# Altium schematic sheet MCU.SchDoc
size A4
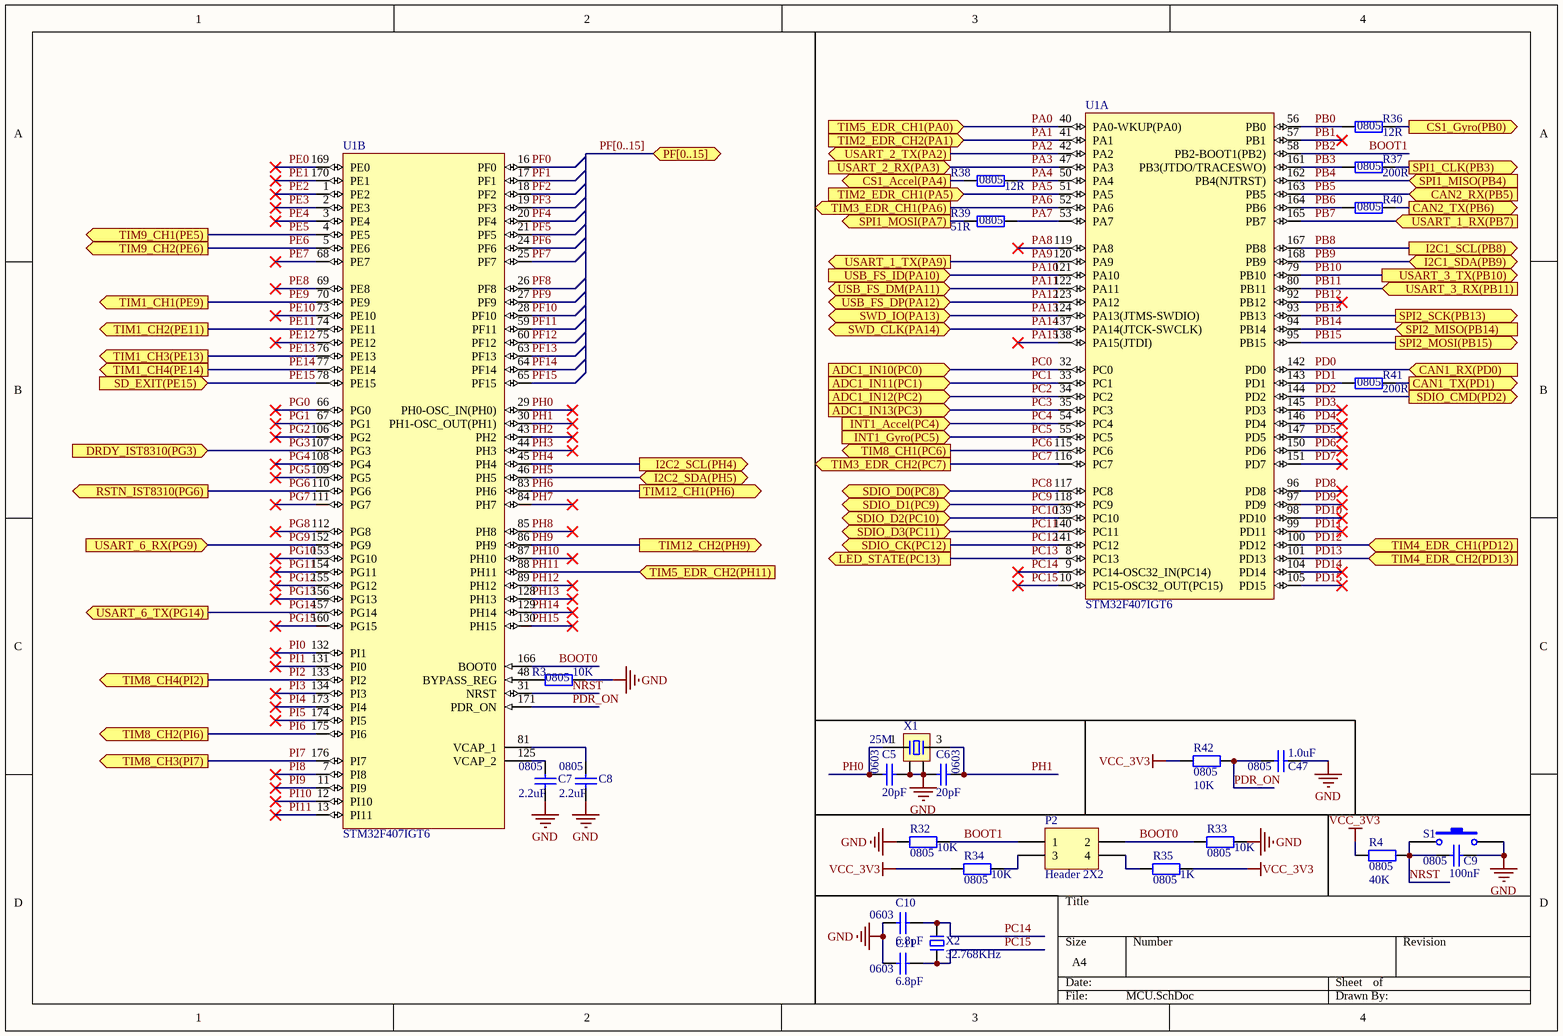
[diagram p0: MCU.SchDoc]

## Parts
C5  0603  value 20pF  [C 0603_L]
C6  0603  value 20pF  [C 0603_L]
C7  0805  value 2.2uF  [C 0805_M]
C8  0805  value 2.2uF  [C 0805_M]
C9  0805  value 100nF  [C 0805_M]
C10  0603  value 6.8pF  [C 0603_M]
C11  0603  value 6.8pF  [C 0603_L]
C47  0805  value 1.0uF  [C 0805_M]
P2  Header 2X2  [HDR2.54-LI-2x2P]
R3  0805  value 10K  [R 0805_L]
R4  0805  value 40K  [R 0805_L]
R32  0805  value 10K  [R 0805_L]
R33  0805  value 10K  [R 0805_L]
R34  0805  value 10K  [R 0805_L]
R35  0805  value 1K  [R 0805_L]
R36  0805  value 12R  [R 0805_L]
R37  0805  value 200R  [R 0805_L]
R38  0805  value 12R  [R 0805_L]
R39  0805  value 51R  [R 0805_L]
R40  0805  [R 0805_L]
R41  0805  value 200R  [R 0805_L]
R42  0805  value 10K  [R 0805_L]
S1  SW  [TSW DIP-3*6*4.3]  (value not drawn)
U1  STM32F407IGT6  [STM-LQFP176_N]  (parts A,B of 3)
X1  25M  [XTAL-3225]
X2  32.768KHz  [XTAL-3215A]

## Ports
ADC1_IN10(PC0) (in), ADC1_IN11(PC1) (in), ADC1_IN12(PC2) (in), ADC1_IN13(PC3) (in), CAN1_RX(PD0) (in), CAN1_TX(PD1) (out), CAN2_RX(PB5) (in), CAN2_TX(PB6) (out), CS1_Accel(PA4) (out), CS1_Gyro(PB0) (out), DRDY_IST8310(PG3) (in), I2C1_SCL(PB8) (out), I2C1_SDA(PB9) (bidir), I2C2_SCL(PH4) (out), I2C2_SDA(PH5) (bidir), INT1_Accel(PC4) (in), INT1_Gyro(PC5) (in), LED_STATE(PC13) (out), PF[0..15] (bidir), RSTN_IST8310(PG6) (out), SD_EXIT(PE15) (in), SDIO_CK(PC12) (out), SDIO_CMD(PD2) (out), SDIO_D0(PC8) (bidir), SDIO_D1(PC9) (bidir), SDIO_D2(PC10) (bidir), SDIO_D3(PC11) (bidir), SPI1_CLK(PB3) (out), SPI1_MISO(PB4) (in), SPI1_MOSI(PA7) (out), SPI2_MISO(PB14) (in), SPI2_MOSI(PB15) (out), SPI2_SCK(PB13) (out), SWD_CLK(PA14) (bidir), SWD_IO(PA13) (bidir), TIM1_CH1(PE9) (out), TIM1_CH2(PE11) (out), TIM1_CH3(PE13) (out), TIM1_CH4(PE14) (out), TIM2_EDR_CH1(PA5) (in), TIM2_EDR_CH2(PA1) (in), TIM3_EDR_CH1(PA6) (out), TIM3_EDR_CH2(PC7) (out), TIM4_EDR_CH1(PD12) (in), TIM4_EDR_CH2(PD13) (in), TIM5_EDR_CH1(PA0) (in), TIM5_EDR_CH2(PH11) (in), TIM8_CH1(PC6) (out), TIM8_CH2(PI6) (out), TIM8_CH3(PI7) (out), TIM8_CH4(PI2) (out), TIM9_CH1(PE5) (out), TIM9_CH2(PE6) (out), TIM12_CH1(PH6) (out), TIM12_CH2(PH9) (out), USART_1_RX(PB7) (in), USART_1_TX(PA9) (out), USART_2_RX(PA3) (in), USART_2_TX(PA2) (out), USART_3_RX(PB11) (in), USART_3_TX(PB10) (out), USART_6_RX(PG9) (in), USART_6_TX(PG14) (out), USB_FS_DM(PA11) (bidir), USB_FS_DP(PA12) (bidir), USB_FS_ID(PA10) (in)

## Nets
GND: C5.2 C6.1 C7.1 C8.1 C9.1 C10.1 C11.1 C47.1 R3.2 R32.1 R33.2 S1.2 X1.2 X1.4
VCC_3V3: R4.1 R34.1 R35.2 R42.1
BOOT0: P2.2 R33.1 U1.166(BOOT0)
BOOT1: P2.1 R32.2 U1.58(PB2-BOOT1(PB2))  [also labelled PB2]
CAN1_TX(PD1): R41.2 ; port CAN1_TX(PD1)
CAN2_TX(PB6): R40.2 ; port CAN2_TX(PB6)
CS1_Accel(PA4): R38.1 ; port CS1_Accel(PA4)
CS1_Gyro(PB0): R36.2 ; port CS1_Gyro(PB0)
NRST: C9.2 R4.2 S1.1 U1.31(NRST)
PA0: U1.40(PA0-WKUP(PA0)) ; port TIM5_EDR_CH1(PA0)
PA1: U1.41(PA1) ; port TIM2_EDR_CH2(PA1)
PA2: U1.42(PA2) ; port USART_2_TX(PA2)
PA3: U1.47(PA3) ; port USART_2_RX(PA3)
PA4: R38.2 U1.50(PA4)
PA5: U1.51(PA5) ; port TIM2_EDR_CH1(PA5)
PA6: U1.52(PA6) ; port TIM3_EDR_CH1(PA6)
PA7: R39.2 U1.53(PA7)
PA8: U1.119(PA8)
PA9: U1.120(PA9) ; port USART_1_TX(PA9)
PA10: U1.121(PA10) ; port USB_FS_ID(PA10)
PA11: U1.122(PA11) ; port USB_FS_DM(PA11)
PA12: U1.123(PA12) ; port USB_FS_DP(PA12)
PA13: U1.124(PA13(JTMS-SWDIO)) ; port SWD_IO(PA13)
PA14: U1.137(PA14(JTCK-SWCLK)) ; port SWD_CLK(PA14)
PA15: U1.138(PA15(JTDI))
PB0: R36.1 U1.56(PB0)
PB1: U1.57(PB1)
PB3: R37.1 U1.161(PB3(JTDO/TRACESWO))
PB4: U1.162(PB4(NJTRST)) ; port SPI1_MISO(PB4)
PB5: U1.163(PB5) ; port CAN2_RX(PB5)
PB6: R40.1 U1.164(PB6)
PB7: U1.165(PB7) ; port USART_1_RX(PB7)
PB8: U1.167(PB8) ; port I2C1_SCL(PB8)
PB9: U1.168(PB9) ; port I2C1_SDA(PB9)
PB10: U1.79(PB10) ; port USART_3_TX(PB10)
PB11: U1.80(PB11) ; port USART_3_RX(PB11)
PB12: U1.92(PB12)
PB13: U1.93(PB13) ; port SPI2_SCK(PB13)
PB14: U1.94(PB14) ; port SPI2_MISO(PB14)
PB15: U1.95(PB15) ; port SPI2_MOSI(PB15)
PC0: U1.32(PC0) ; port ADC1_IN10(PC0)
PC1: U1.33(PC1) ; port ADC1_IN11(PC1)
PC2: U1.34(PC2) ; port ADC1_IN12(PC2)
PC3: U1.35(PC3) ; port ADC1_IN13(PC3)
PC4: U1.54(PC4) ; port INT1_Accel(PC4)
PC5: U1.55(PC5) ; port INT1_Gyro(PC5)
PC6: U1.115(PC6) ; port TIM8_CH1(PC6)
PC7: U1.116(PC7) ; port TIM3_EDR_CH2(PC7)
PC8: U1.117(PC8) ; port SDIO_D0(PC8)
PC9: U1.118(PC9) ; port SDIO_D1(PC9)
PC10: U1.139(PC10) ; port SDIO_D2(PC10)
PC11: U1.140(PC11) ; port SDIO_D3(PC11)
PC12: U1.141(PC12) ; port SDIO_CK(PC12)
PC13: U1.8(PC13) ; port LED_STATE(PC13)
PC14: C10.2 U1.9(PC14-OSC32_IN(PC14)) X2.2
PC15: C11.2 U1.10(PC15-OSC32_OUT(PC15)) X2.1
PD0: U1.142(PD0) ; port CAN1_RX(PD0)
PD1: R41.1 U1.143(PD1)
PD2: U1.144(PD2) ; port SDIO_CMD(PD2)
PD3: U1.145(PD3)
PD4: U1.146(PD4)
PD5: U1.147(PD5)
PD6: U1.150(PD6)
PD7: U1.151(PD7)
PD8: U1.96(PD8)
PD9: U1.97(PD9)
PD10: U1.98(PD10)
PD11: U1.99(PD11)
PD12: U1.100(PD12) ; port TIM4_EDR_CH1(PD12)
PD13: U1.101(PD13) ; port TIM4_EDR_CH2(PD13)
PD14: U1.104(PD14)
PD15: U1.105(PD15)
PDR_ON: C47.2 R42.2 U1.171(PDR_ON)
PE0: U1.169(PE0)
PE1: U1.170(PE1)
PE2: U1.1(PE2)
PE3: U1.2(PE3)
PE4: U1.3(PE4)
PE5: U1.4(PE5) ; port TIM9_CH1(PE5)
PE6: U1.5(PE6) ; port TIM9_CH2(PE6)
PE7: U1.68(PE7)
PE8: U1.69(PE8)
PE9: U1.70(PE9) ; port TIM1_CH1(PE9)
PE10: U1.73(PE10)
PE11: U1.74(PE11) ; port TIM1_CH2(PE11)
PE12: U1.75(PE12)
PE13: U1.76(PE13) ; port TIM1_CH3(PE13)
PE14: U1.77(PE14) ; port TIM1_CH4(PE14)
PE15: U1.78(PE15) ; port SD_EXIT(PE15)
PF0: U1.16(PF0)
PF1: U1.17(PF1)
PF2: U1.18(PF2)
PF3: U1.19(PF3)
PF4: U1.20(PF4)
PF5: U1.21(PF5)
PF6: U1.24(PF6)
PF7: U1.25(PF7)
PF8: U1.26(PF8)
PF9: U1.27(PF9)
PF10: U1.28(PF10)
PF11: U1.59(PF11)
PF12: U1.60(PF12)
PF13: U1.63(PF13)
PF14: U1.64(PF14)
PF15: U1.65(PF15)
PG0: U1.66(PG0)
PG1: U1.67(PG1)
PG2: U1.106(PG2)
PG3: U1.107(PG3) ; port DRDY_IST8310(PG3)
PG4: U1.108(PG4)
PG5: U1.109(PG5)
PG6: U1.110(PG6) ; port RSTN_IST8310(PG6)
PG7: U1.111(PG7)
PG8: U1.112(PG8)
PG9: U1.152(PG9) ; port USART_6_RX(PG9)
PG10: U1.153(PG10)
PG11: U1.154(PG11)
PG12: U1.155(PG12)
PG13: U1.156(PG13)
PG14: U1.157(PG14) ; port USART_6_TX(PG14)
PG15: U1.160(PG15)
PH0: C5.1 U1.29(PH0-OSC_IN(PH0)) X1.1
PH1: C6.2 U1.30(PH1-OSC_OUT(PH1)) X1.3
PH2: U1.43(PH2)
PH3: U1.44(PH3)
PH4: U1.45(PH4) ; port I2C2_SCL(PH4)
PH5: U1.46(PH5) ; port I2C2_SDA(PH5)
PH6: U1.83(PH6) ; port TIM12_CH1(PH6)
PH7: U1.84(PH7)
PH8: U1.85(PH8)
PH9: U1.86(PH9) ; port TIM12_CH2(PH9)
PH10: U1.87(PH10)
PH11: U1.88(PH11) ; port TIM5_EDR_CH2(PH11)
PH12: U1.89(PH12)
PH13: U1.128(PH13)
PH14: U1.129(PH14)
PH15: U1.130(PH15)
PI0: U1.132(PI1)
PI1: U1.131(PI0)
PI2: U1.133(PI2) ; port TIM8_CH4(PI2)
PI3: U1.134(PI3)
PI4: U1.173(PI4)
PI5: U1.174(PI5)
PI6: U1.175(PI6) ; port TIM8_CH2(PI6)
PI7: U1.176(PI7) ; port TIM8_CH3(PI7)
PI8: U1.7(PI8)
PI9: U1.11(PI9)
PI10: U1.12(PI10)
PI11: U1.13(PI11)
SPI1_CLK(PB3): R37.2 ; port SPI1_CLK(PB3)
SPI1_MOSI(PA7): R39.1 ; port SPI1_MOSI(PA7)
NetC7_2: C7.2 U1.125(VCAP_2)
NetC8_2: C8.2 U1.81(VCAP_1)
NetP2_3: P2.3 R34.2
NetP2_4: P2.4 R35.1
NetR3_1: R3.1 U1.48(BYPASS_REG)

## Buses and harness runs
bus PF[0..15] = port PF[0..15]

## Library data of the parts
C5-C11 C47 = CAP
P2 = Header 2X2: Header, 2-Pin, Dual row; LatestRevisionDate: 17-Jul-2002; LatestRevisionNote: Re-released for DXP Platform.; Publisher: Altium Limited
R3 R4 R32-R42 = RES2: Resistor; Published: 8-Jun-2000; LatestRevisionDate: 17-Jul-2002; LatestRevisionNote: Re-released for DXP Platform.; PackageReference: AXIAL-0.3; Publisher: Altium Limited; PackageDescription: Axial Device, Thru-Hole; 2 Leads; 0.3 in Pin Spacing
U1 = STM32F407IGT6: ARM Cortex-M4 32-bit MCU+FPU, 210 DMIPS, 1024 kB Flash, 192 kB Internal RAM, 140 I/Os, 176-pin LQFP, -40 to 85 degC, Tray; Manufacturer: STMicroelectronics; D/A Converter: 2x12-bit; FLASH Size (Prog) (kB): 1024; I/Os (High Current): 140; Internal RAM Size (kB): 192; Operating Frequency(F) (Processor speed) (MHz): 168; Supply Voltage(Vcc) max (V): 3.6; Supply Voltage(Vcc) min (V): 1.8; DatasheetVersion: Rev. 4; PackageVersion: Rev. 4, 06/2013; PackageReference: LQFP176; PackageDescription: 176-Pin Low Profile Quad Flat Package, 24 x 24 mm Body, 0.5 mm Pitch; Supplier 1: Digi-Key; Supplier Part Number 1: 497-11604-ND; Supplier 2: Farnell; Supplier Part Number 2: 2064366; Supplier 3: Newark; Supplier Part Number 3: 73T2331; Supplier 4: Mouser; Supplier Part Number 4: 511-STM32F407IGT6; Core: ARM Cortex-M4; Packing: Tray; Mounting Technology: Surface Mount; PartNumber: STM32F407IGT6; ComponentLink1Description: Manufacturer URL; ComponentLink1URL: http://www.st.com/web/en/home.html; ComponentLink2Description: Datasheet; ComponentLink2URL: http://www.st.com/st-web-ui/static/active/en/resource/technical/document/datasheet/DM00037051.pdf; ComponentLink3Description: Package Specification; ComponentLink3URL: http://www.st.com/st-web-ui/static/active/en/resource/technical/document/datasheet/DM00035129.pdf
X1 = XTAL-4: 4脚晶振; 版权归属: 源创客; BOM名称: 4脚晶振; 学习资源: www.ooocke.com
X2 = XTAL-2: 2脚晶振; 版权归属: 源创客; BOM名称: 2脚晶振; 学习资源: www.ooocke.com
S1 = SW: Published: 24-Mar-1999; LatestRevisionDate: 17-Jul-2002; LatestRevisionNote: Re-released for DXP Platform.; Publisher: Altium Limited